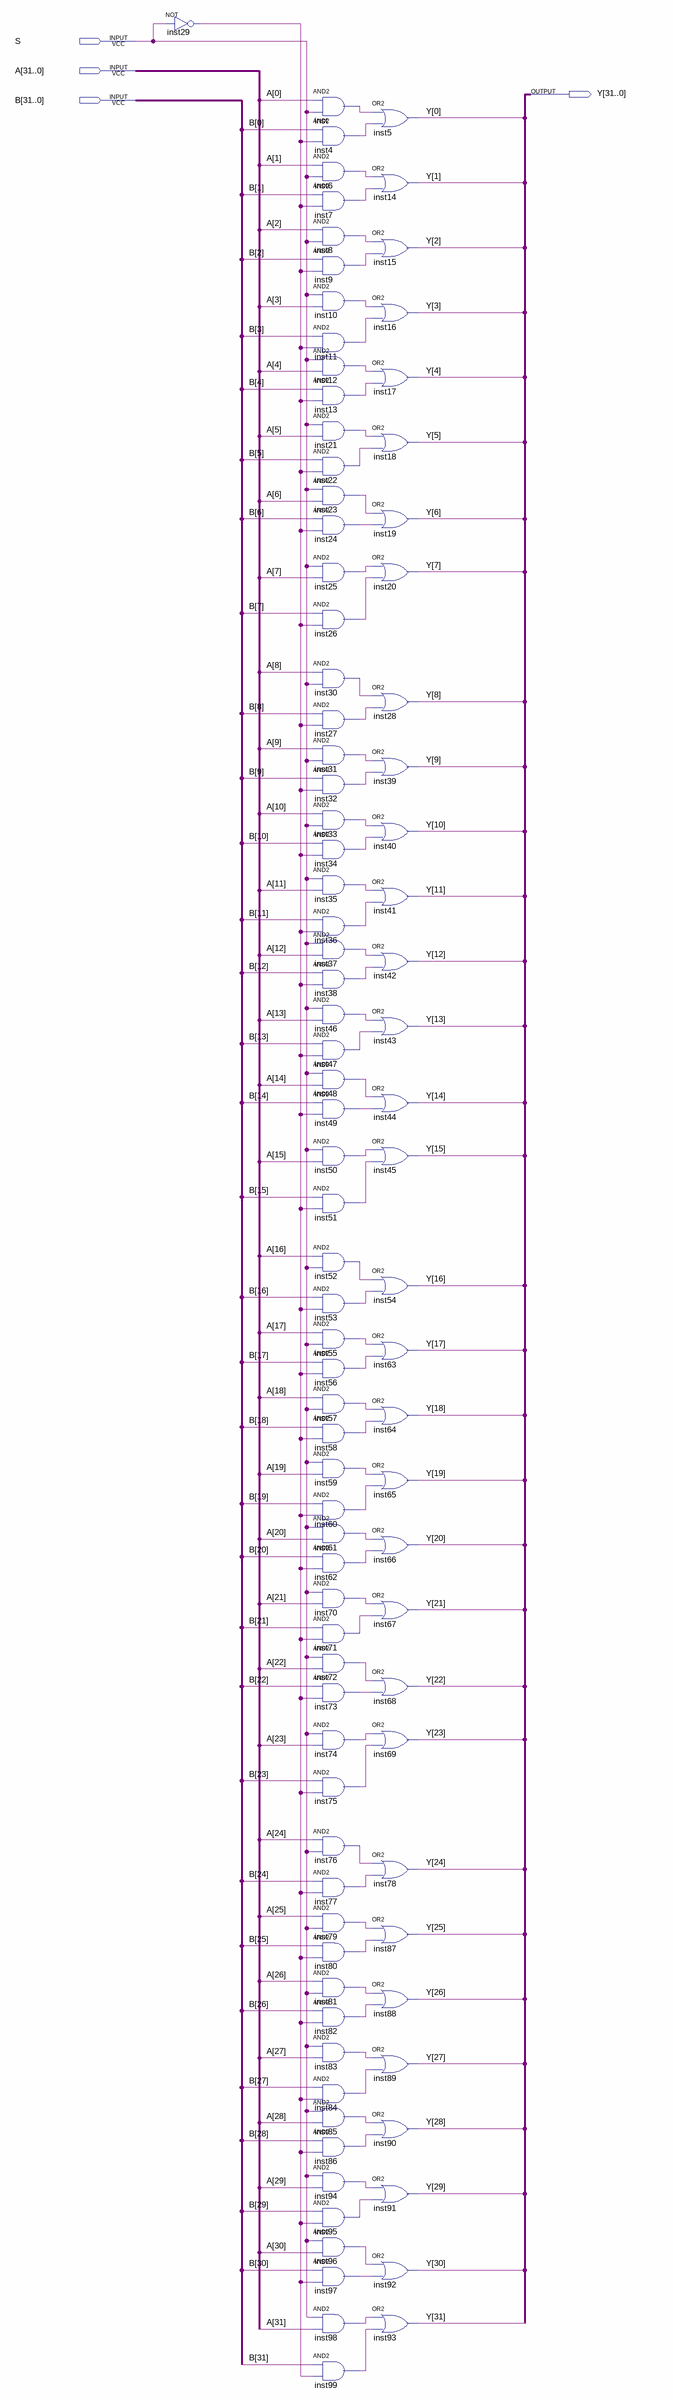
[diagram p0: schematic sheet]
// Quartus schematic MUX2X31.bdf as structural Verilog: 97 symbols, 4 pins
module MUX2X31 (
  input  S,
  input  [31:0] A,
  input  [31:0] B,
  output [31:0] Y
);

  wire inst4_out, inst6_out, inst7_out, inst8_out, inst9_out, inst10_out, inst11_out, inst12_out, inst13_out,
       inst21_out, inst22_out, inst23_out, inst24_out, inst25_out, inst26_out, inst27_out, inst29_out,
       inst30_out, inst31_out, inst32_out, inst33_out, inst34_out, inst35_out, inst36_out, inst37_out,
       inst38_out, inst46_out, inst47_out, inst48_out, inst49_out, inst50_out, inst51_out, inst52_out,
       inst53_out, inst55_out, inst56_out, inst57_out, inst58_out, inst59_out, inst60_out, inst61_out,
       inst62_out, inst70_out, inst71_out, inst72_out, inst73_out, inst74_out, inst75_out, inst76_out,
       inst77_out, inst79_out, inst80_out, inst81_out, inst82_out, inst83_out, inst84_out, inst85_out,
       inst86_out, inst94_out, inst95_out, inst96_out, inst97_out, inst98_out, inst99_out, inst_out;

  not inst29 (inst29_out, S);
  and inst (inst_out, A[0], S);
  and inst4 (inst4_out, B[0], inst29_out);
  and inst6 (inst6_out, A[1], S);
  and inst7 (inst7_out, B[1], inst29_out);
  and inst8 (inst8_out, A[2], S);
  and inst9 (inst9_out, B[2], inst29_out);
  and inst10 (inst10_out, S, A[3]);
  and inst11 (inst11_out, B[3], inst29_out);
  and inst12 (inst12_out, S, A[4]);
  and inst13 (inst13_out, B[4], inst29_out);
  and inst21 (inst21_out, S, A[5]);
  and inst22 (inst22_out, B[5], inst29_out);
  and inst23 (inst23_out, S, A[6]);
  and inst24 (inst24_out, B[6], inst29_out);
  and inst25 (inst25_out, S, A[7]);
  and inst26 (inst26_out, B[7], inst29_out);
  and inst30 (inst30_out, A[8], S);
  and inst27 (inst27_out, B[8], inst29_out);
  and inst31 (inst31_out, A[9], S);
  and inst32 (inst32_out, B[9], inst29_out);
  and inst33 (inst33_out, A[10], S);
  and inst34 (inst34_out, B[10], inst29_out);
  and inst35 (inst35_out, S, A[11]);
  and inst36 (inst36_out, B[11], inst29_out);
  and inst37 (inst37_out, S, A[12]);
  and inst38 (inst38_out, B[12], inst29_out);
  and inst46 (inst46_out, S, A[13]);
  and inst47 (inst47_out, B[13], inst29_out);
  and inst48 (inst48_out, S, A[14]);
  and inst49 (inst49_out, B[14], inst29_out);
  and inst50 (inst50_out, S, A[15]);
  and inst51 (inst51_out, B[15], inst29_out);
  and inst52 (inst52_out, A[16], S);
  and inst53 (inst53_out, B[16], inst29_out);
  and inst55 (inst55_out, A[17], S);
  and inst56 (inst56_out, B[17], inst29_out);
  and inst57 (inst57_out, A[18], S);
  and inst58 (inst58_out, B[18], inst29_out);
  and inst59 (inst59_out, S, A[19]);
  and inst60 (inst60_out, B[19], inst29_out);
  and inst61 (inst61_out, S, A[20]);
  and inst62 (inst62_out, B[20], inst29_out);
  and inst70 (inst70_out, S, A[21]);
  and inst71 (inst71_out, B[21], inst29_out);
  and inst72 (inst72_out, S, A[22]);
  and inst73 (inst73_out, B[22], inst29_out);
  and inst74 (inst74_out, S, A[23]);
  and inst75 (inst75_out, B[23], inst29_out);
  and inst76 (inst76_out, A[24], S);
  and inst77 (inst77_out, B[24], inst29_out);
  and inst79 (inst79_out, A[25], S);
  and inst80 (inst80_out, B[25], inst29_out);
  and inst81 (inst81_out, A[26], S);
  and inst82 (inst82_out, B[26], inst29_out);
  and inst83 (inst83_out, S, A[27]);
  and inst84 (inst84_out, B[27], inst29_out);
  and inst85 (inst85_out, S, A[28]);
  and inst86 (inst86_out, B[28], inst29_out);
  and inst94 (inst94_out, S, A[29]);
  and inst95 (inst95_out, B[29], inst29_out);
  and inst96 (inst96_out, S, A[30]);
  and inst97 (inst97_out, B[30], inst29_out);
  and inst98 (inst98_out, S, A[31]);
  and inst99 (inst99_out, B[31], inst29_out);
  or inst5 (Y[0], inst_out, inst4_out);
  or inst14 (Y[1], inst6_out, inst7_out);
  or inst15 (Y[2], inst8_out, inst9_out);
  or inst16 (Y[3], inst10_out, inst11_out);
  or inst17 (Y[4], inst12_out, inst13_out);
  or inst18 (Y[5], inst21_out, inst22_out);
  or inst19 (Y[6], inst23_out, inst24_out);
  or inst20 (Y[7], inst25_out, inst26_out);
  or inst28 (Y[8], inst30_out, inst27_out);
  or inst39 (Y[9], inst31_out, inst32_out);
  or inst40 (Y[10], inst33_out, inst34_out);
  or inst41 (Y[11], inst35_out, inst36_out);
  or inst42 (Y[12], inst37_out, inst38_out);
  or inst43 (Y[13], inst46_out, inst47_out);
  or inst44 (Y[14], inst48_out, inst49_out);
  or inst45 (Y[15], inst50_out, inst51_out);
  or inst54 (Y[16], inst52_out, inst53_out);
  or inst63 (Y[17], inst55_out, inst56_out);
  or inst64 (Y[18], inst57_out, inst58_out);
  or inst65 (Y[19], inst59_out, inst60_out);
  or inst66 (Y[20], inst61_out, inst62_out);
  or inst67 (Y[21], inst70_out, inst71_out);
  or inst68 (Y[22], inst72_out, inst73_out);
  or inst69 (Y[23], inst74_out, inst75_out);
  or inst78 (Y[24], inst76_out, inst77_out);
  or inst87 (Y[25], inst79_out, inst80_out);
  or inst88 (Y[26], inst81_out, inst82_out);
  or inst89 (Y[27], inst83_out, inst84_out);
  or inst90 (Y[28], inst85_out, inst86_out);
  or inst91 (Y[29], inst94_out, inst95_out);
  or inst92 (Y[30], inst96_out, inst97_out);
  or inst93 (Y[31], inst98_out, inst99_out);
endmodule
